# EAGLE design Printhead_contact_board (EAGLE 9.3.0)
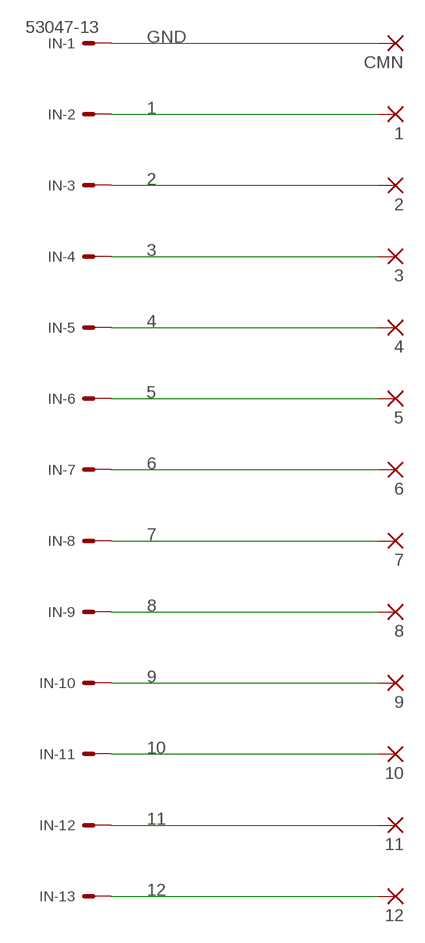
[diagram p0: schematic, sheet 1]

## Parts
1  SMD2  [SMD1,27-2,54]
2  SMD2  [SMD1,27-2,54]
3  SMD2  [SMD1,27-2,54]
4  SMD2  [SMD1,27-2,54]
5  SMD2  [SMD1,27-2,54]
6  SMD2  [SMD1,27-2,54]
7  SMD2  [SMD1,27-2,54]
8  SMD2  [SMD1,27-2,54]
9  SMD2  [SMD1,27-2,54]
10  SMD2  [SMD1,27-2,54]
11  SMD2  [SMD1,27-2,54]
12  SMD2  [SMD1,27-2,54]
CMN  SMD2  [SMD1,27-2,54]
IN  53047-13  [53047-13]

## Nets
1: 1.1(P) IN.2
2: 2.1(P) IN.3
3: 3.1(P) IN.4
4: 4.1(P) IN.5
5: 5.1(P) IN.6
6: 6.1(P) IN.7
7: 7.1(P) IN.8
8: 8.1(P) IN.9
9: 9.1(P) IN.10
10: 10.1(P) IN.11
11: 11.1(P) IN.12
12: 12.1(P) IN.13
GND: CMN.1(P) IN.1

## Library data of the parts
1-12 CMN = wirepad:SMD2: SMD PAD
IN = con-molex:53?-13: CONNECTOR wire to board 1.25 mm (.049 inch) pitch header; MF: MOLEX; MPN: 53047-1310-C; OC_FARNELL: 1012238; OC_NEWARK: 03N7646

## Net classes
0 default: width 0.01 mm, clearance 0.205 mm

## Board
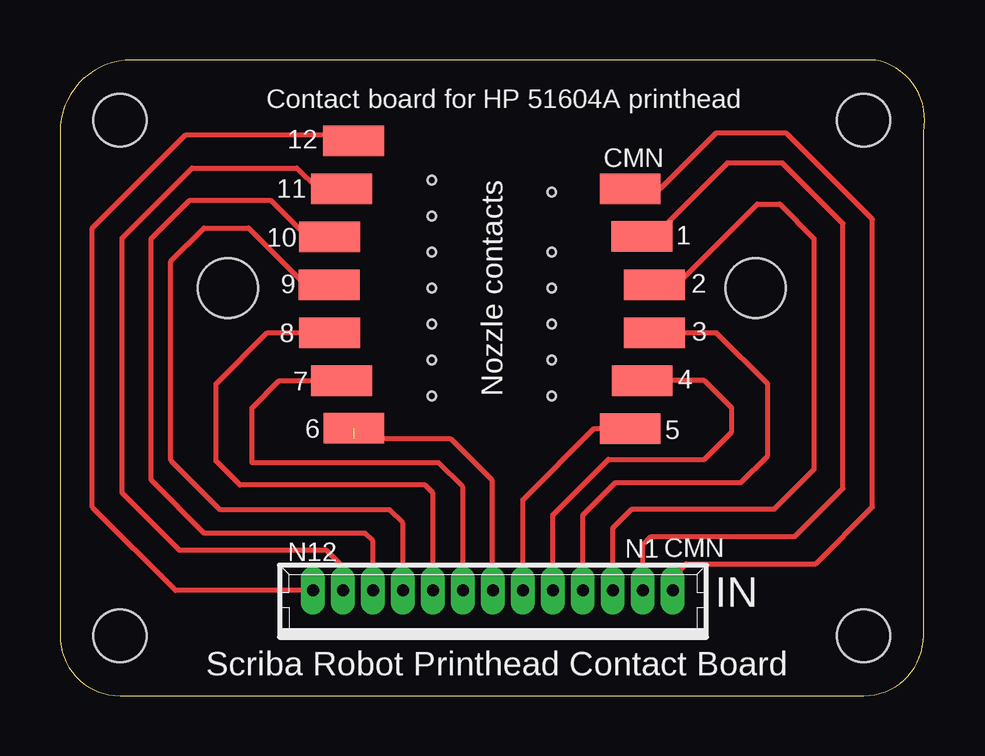
[diagram p1: board, top side]

Size 36.05 x 26.51 mm. Coordinates in mm from the lower left corner, seen from the top.
Outline: 2.5,0 33.5,0 arc90 36,2.5 36,23.51 arc90 34,26.51 3,26.51 arc90 0,23.51 0,2.5 arc90 2.5,0
Copper layers (1*16): Top 0.035mm / dielectric 1.5mm / Bottom 0.035mm
Design rules "Printhead_contact_board *": minimum track width 6mil, minimum drill 0.35mm, track to track 0.3mm, track to pad 0.5mm, pad to pad 0.205mm, via to via 0.205mm, smd to smd 6mil, copper to edge 40mil, drill to drill 0.5mm, minimum pad ring 10mil, minimum via ring 8mil, stop-mask expansion 4mil, vias tented up to drill 0mil, thermal gap 10mil
Holes 0.35 mm at 15.5,21.5 15.5,20 15.5,18.5 15.5,15.5 15.5,17 15.5,12.5 15.5,14 20.5,21 20.5,18.5 20.5,15.5 20.5,17 20.5,12.5 20.5,14
Holes 2.5 mm at 7,17 29,17
Holes 2.2 mm at 2.5,2.5 33.5,2.5 33.5,24 2.5,24

### Footprints (pad centres in the part's own frame; a part is rotated, then mirrored left to right if it is on the bottom)
SMD1,27-2,54 = smd 1.27 x 2.54: 1 0,0
53047-13 = drill 0.5 pad 0.698 long: 1 7.5,0.45; 2 6.25,0.45; 3 5,0.45; 4 3.75,0.45; 5 2.5,0.45; 6 1.25,0.45; 7 0,0.45; 8 -1.25,0.45; 9 -2.5,0.45; 10 -3.75,0.45; 11 -5,0.45; 12 -6.25,0.45; 13 -7.5,0.45

### Placement (x,y rotation side)
1  24.26,19.15 90 top
2  24.78,17.14 90 top
3  24.78,15.13 90 top
4  24.27,13.14 90 top
5  23.77,11.14 90 top
6  12.25,11.15 270 top
7  11.73,13.14 90 top
8  11.23,15.14 90 top
9  11.22,17.14 90 top
10  11.23,19.14 90 top
11  11.73,21.14 90 top
12  12.23,23.14 90 top
CMN  23.77,21.14 90 top
IN  18.05,3.94 0 top

### Tracks (layer width: path | path; a pad name or v marks a point on that pad's centre or on a via)
1
  Top 0.2: IN.2 24.3,6.3 24.64,6.64 30.64,6.64 32.64,8.64 32.64,19.69 30.12,22.21 27.82,22.21 24.76,19.15 1.1
2
  Top 0.2: IN.3 23.05,6.99 23.85,7.79 29.79,7.79 31.43,9.43 31.43,19.07 30,20.5 29.07,20.5 25.71,17.14 2.1
3
  Top 0.2: IN.4 21.8,7.54 23.15,8.89 28.39,8.89 29.5,10 29.5,13 27.37,15.13 3.1
4
  Top 0.2: IN.5 20.55,7.55 22.86,9.86 26.86,9.86 28,11 28,12 26.86,13.14 4.1
5
  Top 0.2: IN.6 19.3,8.17 22.27,11.14 5.1
6  (1 unrouted)
  Top 0.2: IN.7 18,4.44 18,9 16.3,10.7 12.25,10.7
7
  Top 0.2: IN.8 16.8,8.7 15.79,9.71 8,9.71 8,12 9.14,13.14 7.1
8
  Top 0.2: IN.9 15.55,8.45 15.21,8.79 7.5,8.79 6.5,9.79 6.5,13 8.64,15.14 8.1
9
  Top 0.2: IN.10 14.3,7.2 13.74,7.76 6.68,7.76 4.62,9.82 4.62,18.12 6,19.5 7.86,19.5 10.22,17.14 9.1
10
  Top 0.2: IN.11 13.05,6.45 12.72,6.78 6.02,6.78 3.8,9 3.8,19.06 5.38,20.64 8.81,20.64 10.31,19.14 10.1
11
  Top 0.2: IN.12 11.8,5.38 11.11,6.07 4.98,6.07 2.59,8.46 2.59,19.09 5.5,22 9.87,22 10.73,21.14 11.1
12
  Top 0.2: IN.13 4.82,4.39 1.35,7.86 1.35,19.5 5.24,23.39 11.98,23.39 12.1
GND
  Top 0.2: IN.1 25.55,4.94 26.11,5.5 31.5,5.5 33.87,7.87 33.87,19.87 30.29,23.45 27.34,23.45 25.03,21.14 CMN.1

### Text on the board
tNames: Contact board for HP 51604A printhead | 11 | 10 | 9 | Nozzle contacts | 2 | 8 | 3 | 7 | 4 | N12 | N1 | CMN | Scriba Robot Printhead Contact Board
bNames: PCB by Robin Baran / Revision 1 (07/2019)